# Altium schematic sheet ili9341-SpiLcd.SchDoc
size A; SheetNumber: 1; SheetTotal: 12
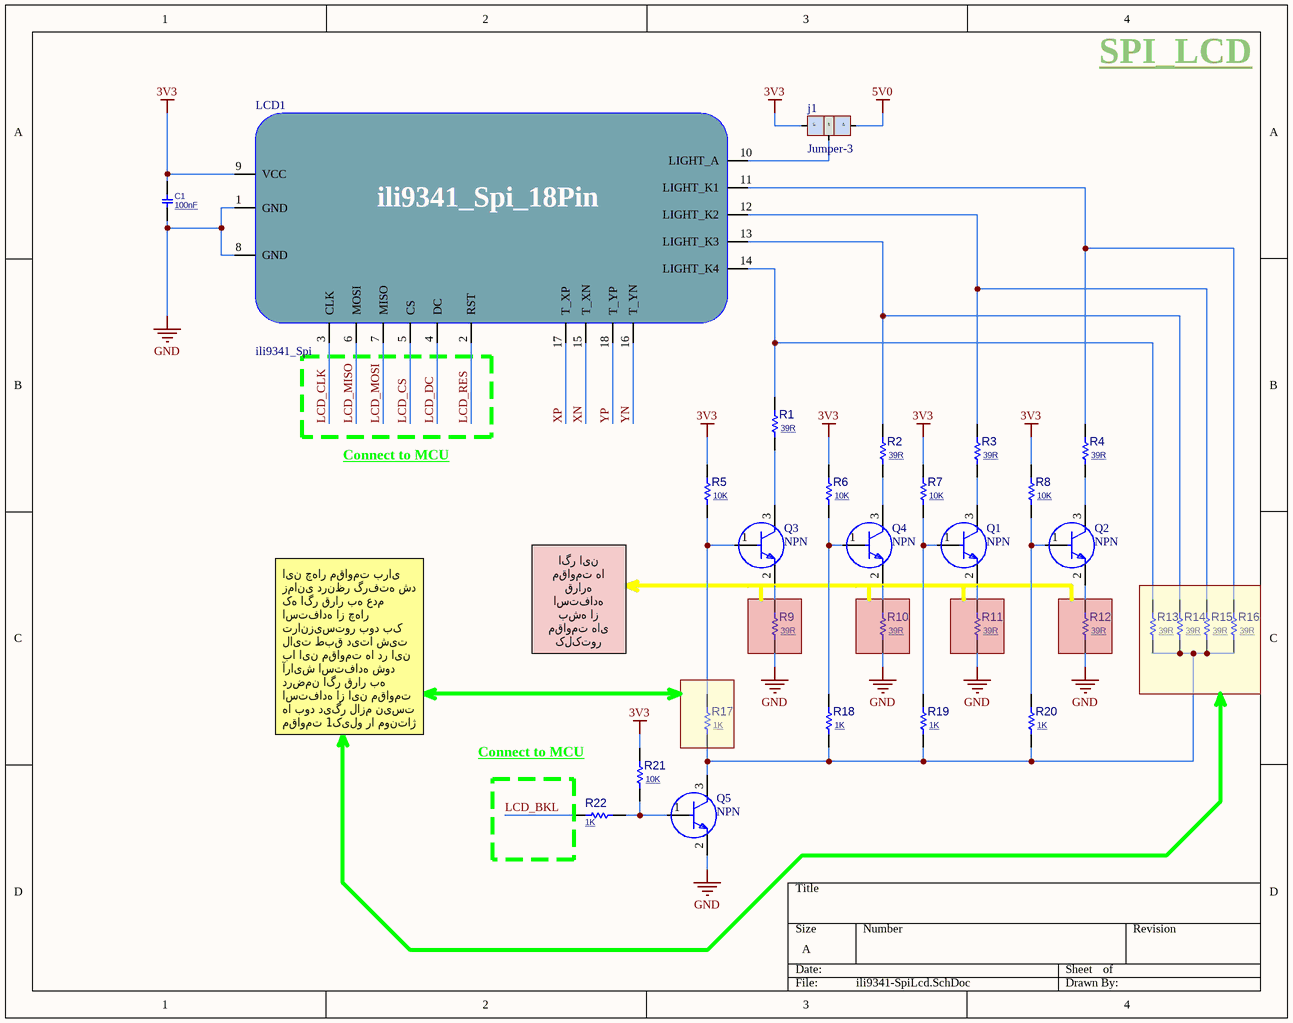
[diagram p0: ili9341-SpiLcd.SchDoc]

## Parts
C1  100nF  [C0603]
j1  Jumper-3  [jumper-3]
LCD1  ili9341_Spi  [ILI9341_Spi_18Pin_2]
Q1  NPN  [FP-SOT23-IPC_A]
Q2  NPN  [FP-SOT23-IPC_A]
Q3  NPN  [FP-SOT23-IPC_A]
Q4  NPN  [FP-SOT23-IPC_A]
Q5  NPN  [FP-SOT23-IPC_A]
R1  39R  [R0603]
R2  39R  [R0603]
R3  39R  [R0603]
R4  39R  [R0603]
R5  10K  [R0603]
R6  10K  [R0603]
R7  10K  [R0603]
R8  10K  [R0603]
R9  39R  [R0603]
R10  39R  [R0603]
R11  39R  [R0603]
R12  39R  [R0603]
R13  39R  [R0603]
R14  39R  [R0603]
R15  39R  [R0603]
R16  39R  [R0603]
R17  1K  [R0603]
R18  1K  [R0603]
R19  1K  [R0603]
R20  1K  [R0603]
R21  10K  [R0603]
R22  1K  [R0603]

## Nets
3V3: C1.2 j1.3 LCD1.9(VCC) R5.2 R6.2 R7.2 R8.2 R21.2
5V0: j1.1
GND: C1.1 LCD1.1(GND) LCD1.8(GND) Q5.2(E) R9.1 R10.1 R11.1 R12.1
LCD_BKL: R22.2
LCD_CLK: LCD1.3(CLK)
LCD_CS: LCD1.5(CS)
LCD_DC: LCD1.4(DC)
LCD_MISO: LCD1.6(MOSI)
LCD_MOSI: LCD1.7(MISO)
LCD_RES: LCD1.2(RST)
XN: LCD1.15(T_XN)
XP: LCD1.17(T_XP)
YN: LCD1.16(T_YN)
YP: LCD1.18(T_YP)
Netj1_2: j1.2 LCD1.10(LIGHT_A)
NetLCD1_11: LCD1.11(LIGHT_K1) R4.2 R16.2
NetLCD1_12: LCD1.12(LIGHT_K2) R3.2 R15.2
NetLCD1_13: LCD1.13(LIGHT_K3) R2.2 R14.2
NetLCD1_14: LCD1.14(LIGHT_K4) R1.2 R13.2
NetQ1_1: Q1.1(B) R7.1 R19.2
NetQ1_2: Q1.2(E) R11.2
NetQ1_3: Q1.3(C) R3.1
NetQ2_1: Q2.1(B) R8.1 R20.2
NetQ2_2: Q2.2(E) R12.2
NetQ2_3: Q2.3(C) R4.1
NetQ3_1: Q3.1(B) R5.1 R17.2
NetQ3_2: Q3.2(E) R9.2
NetQ3_3: Q3.3(C) R1.1
NetQ4_1: Q4.1(B) R6.1 R18.2
NetQ4_2: Q4.2(E) R10.2
NetQ4_3: Q4.3(C) R2.1
NetQ5_1: Q5.1(B) R21.1 R22.1
NetQ5_3: Q5.3(C) R13.1 R14.1 R15.1 R16.1 R17.1 R18.1 R19.1 R20.1

## Notes on the sheet
- SPI_LCD
- Connect to MCU
- اگر این مقاومت ها قراره استفاده بشه از مقاومت های کلکتور استفاده نمیکنیم
- این چهار مقاومت برای زمانی درنظر گرفته شد که اگر قرار به عدم استفاده از چهار ترانزیستور بود بک لایت طبق دیتا شیت با این مقاومت ها در این آرایش استفاده شود
  درضمن اگر قرار به استفاده از این مقاومت ها بود دیگر لازم نیست مقاومت 1کیلو را مونتاژ کرد
- (in symbol ili9341_Spi) ili9341_Spi_18Pin
- (in symbol Jumper-3) C; B; A

## Library data of the parts
C1 = CAP_SMD_MLCC_0603: CAP, MLCC, -F, -V, MATERIAL, -%, 0201; PARAM: -, -%; MANF_P#: MANF_PART#; PRICE: 100= 1$; MANF: -; PARAM2: -V; ASSEMBLY: ASSEMBLY; VALUE: 100nF
Q1-Q5 = CMP-2000-04931-2: Frequency: 300MHz; Collector Emitter Voltage (VCEO): 40V; Power Dissipation: 350mW; Element Configuration: Single; Max Power Dissipation: 300mW; Max Collector Current: 200mA; Collector Emitter Saturation Voltage: 300mV; Number of Elements: 1; hFE Min: 100; Collector Base Voltage (VCBO): 60V; Emitter Base Voltage (VEBO): 6V; Contact Plating: Tin; Package Quantity: 3000; Max Frequency: 300MHz; REACH SVHC: No SVHC; Max Operating Temperature: 150°C; Width: 1.4mm; Voltage Rating (DC): 40V; Radiation Hardening: No; Case/Package: SOT-23; Height: 1mm; Collector Emitter Breakdown Voltage: 40V; Length: 3.05mm; Polarity: NPN; Packaging: Tape and Reel; Number of Pins: 3; Min Operating Temperature: -55°C; Gain Bandwidth Product: 300MHz; Mount: Surface Mount; Weight: 0.000282oz; Continuous Collector Current: 200mA; Transition Frequency: 300MHz; Max Breakdown Voltage: 40V; Lead Free: Lead Free
R1-R22 = RES_SMD: RESISTOR, SMD; PARAM: -W; DESC: DESCRIPTION; DIST#: MOUSER; PARAM2: 1%; MANF_P#: -; MANF: -; ASSEMBLY: ASSEMBLY; PRICE: 100= 0.5$
  R1-R4 R9-R16: VALUE: 39R
  R5-R8 R21: VALUE: 10K
  R17-R20 R22: VALUE: 1K